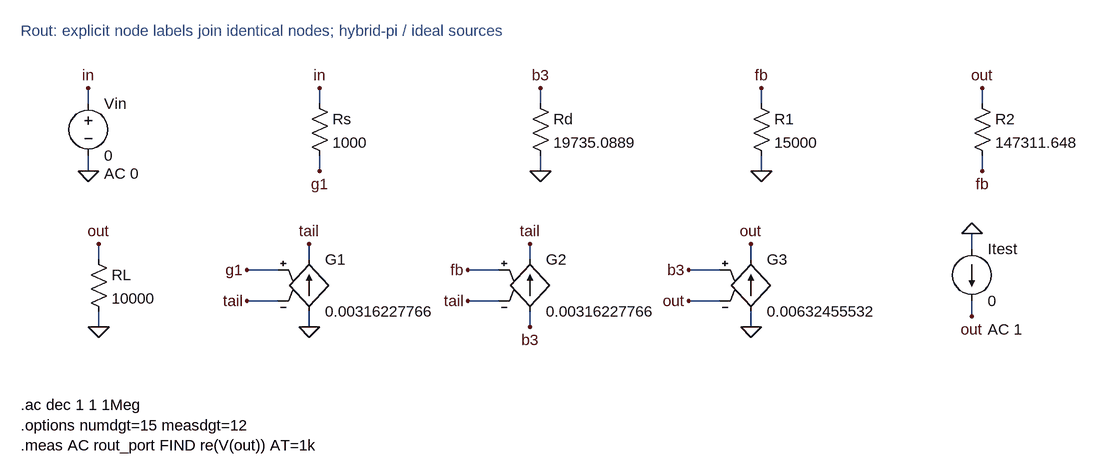
[diagram p0: schematic Rout.asc]
Rout.asc, the LTspice schematic file:
Version 4
SHEET 1 1800 1500
TEXT 16 -48 Left 2 ;Rout: explicit node labels join identical nodes; hybrid-pi / ideal sources
WIRE 120 64 120 40
FLAG 120 40 in
WIRE 120 144 120 168
FLAG 120 168 0
SYMBOL voltage 120 48 R0
SYMATTR InstName Vin
WINDOW 123 24 124 Left 2
SYMATTR Value 0
SYMATTR Value2 AC 0
WIRE 476 64 476 40
FLAG 476 40 in
WIRE 476 144 476 168
FLAG 476 168 g1
SYMBOL res 460 48 R0
SYMATTR InstName Rs
SYMATTR Value 1000
WIRE 816 64 816 40
FLAG 816 40 b3
WIRE 816 144 816 168
FLAG 816 168 0
SYMBOL res 800 48 R0
SYMATTR InstName Rd
SYMATTR Value 19735.0889
WIRE 1156 64 1156 40
FLAG 1156 40 fb
WIRE 1156 144 1156 168
FLAG 1156 168 0
SYMBOL res 1140 48 R0
SYMATTR InstName R1
SYMATTR Value 15000
WIRE 1496 64 1496 40
FLAG 1496 40 out
WIRE 1496 144 1496 168
FLAG 1496 168 fb
SYMBOL res 1480 48 R0
SYMATTR InstName R2
SYMATTR Value 147311.648
WIRE 136 304 136 280
FLAG 136 280 out
WIRE 136 384 136 408
FLAG 136 408 0
SYMBOL res 120 288 R0
SYMATTR InstName RL
SYMATTR Value 10000
WIRE 460 384 460 408
FLAG 460 408 0
WIRE 460 304 460 280
FLAG 460 280 tail
WIRE 412 320 364 320
FLAG 364 320 g1
WIRE 412 368 364 368
FLAG 364 368 tail
SYMBOL g 460 288 R0
SYMATTR InstName G1
SYMATTR Value 0.00316227766
WIRE 800 384 800 408
FLAG 800 408 b3
WIRE 800 304 800 280
FLAG 800 280 tail
WIRE 752 320 704 320
FLAG 704 320 fb
WIRE 752 368 704 368
FLAG 704 368 tail
SYMBOL g 800 288 R0
SYMATTR InstName G2
SYMATTR Value 0.00316227766
WIRE 1140 384 1140 408
FLAG 1140 408 0
WIRE 1140 304 1140 280
FLAG 1140 280 out
WIRE 1092 320 1044 320
FLAG 1044 320 b3
WIRE 1092 368 1044 368
FLAG 1044 368 out
SYMBOL g 1140 288 R0
SYMATTR InstName G3
SYMATTR Value 0.00632455532
WIRE 1480 288 1480 264
FLAG 1480 264 0
WIRE 1480 368 1480 392
FLAG 1480 392 out
SYMBOL current 1480 288 R0
SYMATTR InstName Itest
WINDOW 123 24 124 Left 2
SYMATTR Value 0
SYMATTR Value2 AC 1
TEXT 16 528 Left 2 !.ac dec 1 1 1Meg\n.options numdgt=15 measdgt=12\n.meas AC rout_port FIND re(V(out)) AT=1k

The netlist it stands for:
* Rout.asc
Vin in 0 0 AC 0
Rs in g1 1000
Rd b3 0 19735.0889
R1 fb 0 15000
R2 out fb 147311.648
RL out 0 10000
G1 0 tail g1 tail 0.00316227766
G2 b3 tail fb tail 0.00316227766
G3 0 out b3 out 0.00632455532
Itest 0 out 0 AC 1
* Rout: explicit node labels join identical nodes; hybrid-pi / ideal sources
.ac dec 1 1 1Meg
.options numdgt=15 measdgt=12
.meas AC rout_port FIND re(V(out)) AT=1k
.backanno
.end

* Results of the author's LTspice run, read from the files saved beside the schematic
* From the log:
*   rout_port: re(V(out))=(32.1570180136dB,0°) at 1000